# EAGLE design mpu9250 (EAGLE 9.6.2)
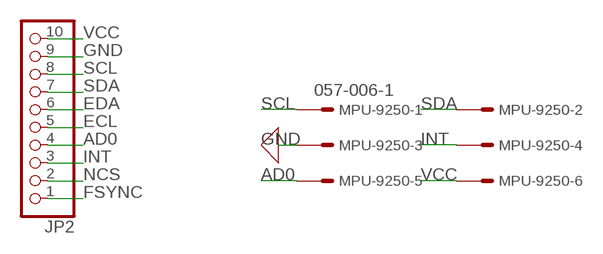
[diagram p0: schematic, sheet 1]

## Parts
JP2  PINHD-1X10  [1X10]
MPU-9250  057-006-1  [057-006-1]

## Nets
AD0: JP2.4 MPU-9250.5
ECL: JP2.5
EDA: JP2.6
FSYNC: JP2.1
GND: JP2.9 MPU-9250.3
INT: JP2.3 MPU-9250.4
NCS: JP2.2
SCL: JP2.8 MPU-9250.1
SDA: JP2.7 MPU-9250.2
VCC: JP2.10 MPU-9250.6

## Library data of the parts
JP2 = pinhead:PINHD-1X10: PIN HEADER
MPU-9250 = con-panduit:057-006-: CONNECTOR 6-pin series 057 contact pc board low profile headers; OC_FARNELL: unknown; OC_NEWARK: unknown

## Board
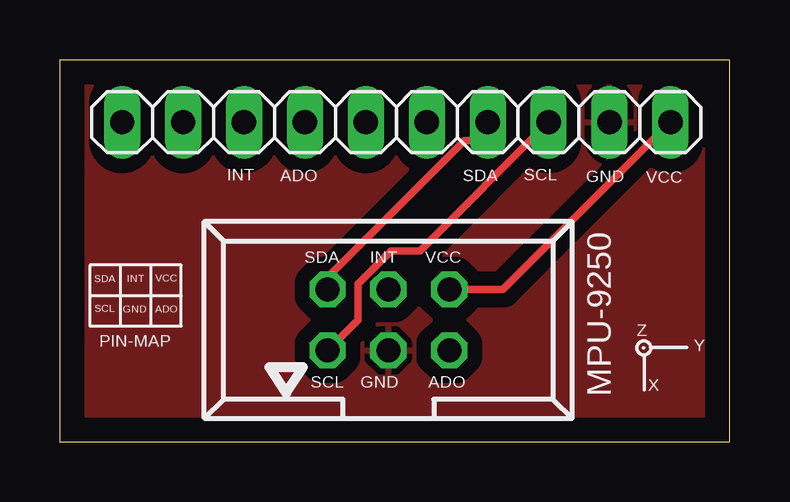
[diagram p1: board, top side]
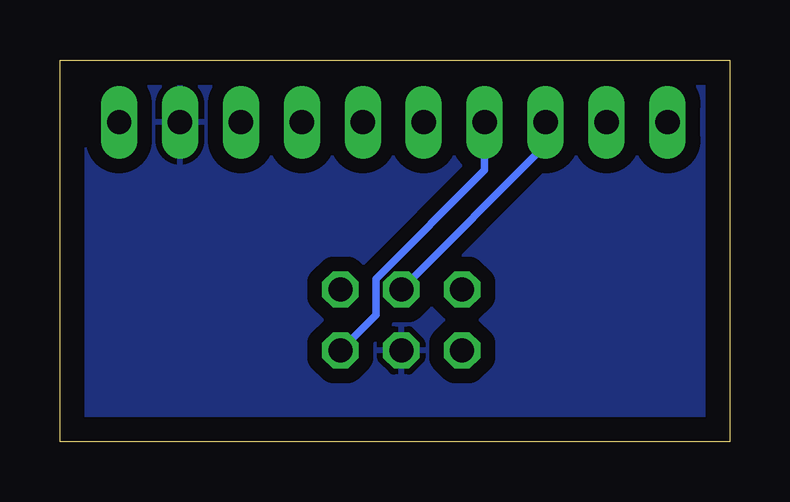
[diagram p2: board, bottom side, seen from below]

Size 27.92 x 15.93 mm. Coordinates in mm from the lower left corner, seen from the top.
Outline: 0,0 27.92,0 27.92,15.93 0,15.93 0,0
Copper layers (1*16): Top 0.035mm / dielectric 1.5mm / Bottom 0.035mm
Design rules "default": minimum track width 6mil, minimum drill 0.35mm, track to track 6mil, track to pad 6mil, pad to pad 6mil, via to via 6mil, smd to smd 6mil, copper to edge 40mil, drill to drill 6mil, minimum pad ring 10mil, minimum via ring 8mil, stop-mask expansion 4mil, vias tented up to drill 0mil, thermal gap 10mil

### Footprints (pad centres in the part's own frame; a part is rotated, then mirrored left to right if it is on the bottom)
1X10 = drill 1.016 long: 1 -11.43,0; 2 -8.89,0; 3 -6.35,0; 4 -3.81,0; 5 -1.27,0; 6 1.27,0; 7 3.81,0; 8 6.35,0; 9 8.89,0; 10 11.43,0
057-006-1 = drill 1 octagon: 1 -2.54,-1.27; 2 -2.54,1.27; 3 0,-1.27; 4 0,1.27; 5 2.54,-1.27; 6 2.54,1.27

### Placement (x,y rotation side)
JP2  14.02,13.33 0 top
MPU-9250  13.69,5.08 0 top

### Tracks (layer width: path | path; a pad name or v marks a point on that pad's centre or on a via)
AD0
  Bottom 0.305: MPU-9250.5 14.75,5.29 14.75,6.79 10.21,11.32 JP2.4
GND
  pour Top (isolate 0.61, rank 2): -0.15,16.13 28.04,16.13 28.04,0.13 -0.15,0.13
  pour Bottom (isolate 0.61, rank 2): -0.15,16.13 28.04,16.13 28.04,0.13 -0.15,0.13
INT
  Bottom 0.305: JP2.3 7.67,12.37 MPU-9250.4
SCL
  Top 0.305: MPU-9250.1 12.42,5.08 12.42,6.58 13.8,7.96 15,7.96 JP2.8
SDA
  Top 0.305: MPU-9250.2 11.15,6.86 16.86,12.57 17.83,12.57 JP2.7
VCC
  Top 0.305: JP2.10 18.47,6.35 MPU-9250.6

### Text on the board
tNames: INT | ADO | SDA | SCL | GND | VCC | SDA | INT | VCC | SDA | INT | VCC | SCL | GND | ADO | Z | PIN-MAP | Y | SCL | GND | ADO | X